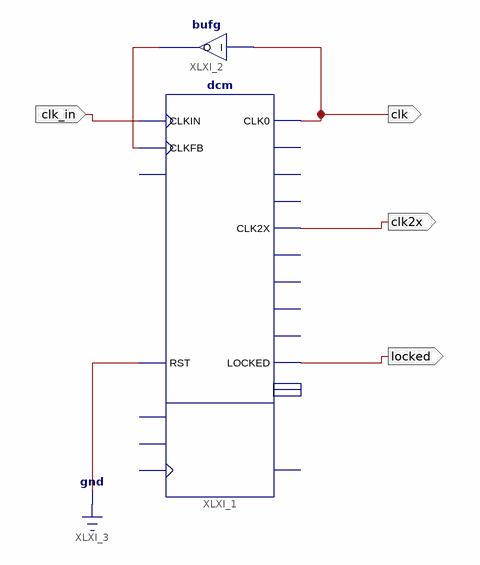
[diagram p0: schematic sheet 1]
// Xilinx ISE schematic clk_dcm.sch (spartan3e) as structural Verilog: 2 symbols, 4 ports
module clk_dcm (
  input  clk_in,
  output clk,
  output clk2x,
  output locked
);

  wire XLXN_3;

  dcm XLXI_1 (
    .CLKFB(XLXN_3), .CLKIN(clk_in), .RST(1'b0), .CLK0(clk), .CLK2X(clk2x), .LOCKED(locked));  // open: DSSEN, PSCLK, PSEN, PSINCDEC, CLK180, CLK270, CLK2X180, CLK90, CLKDV, CLKFX, CLKFX180, PSDONE, STATUS
  bufg XLXI_2 (.I(clk), .O(XLXN_3));
endmodule
